# EAGLE design PiHAT (EAGLE 7.6.0)
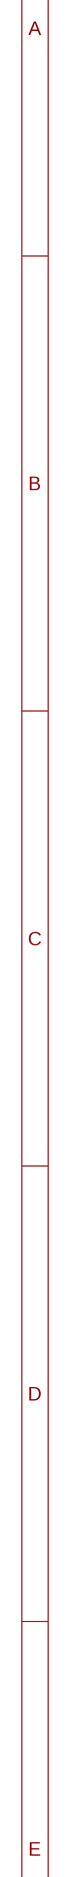
[diagram p0: schematic, sheet 1, part 1 of 2]
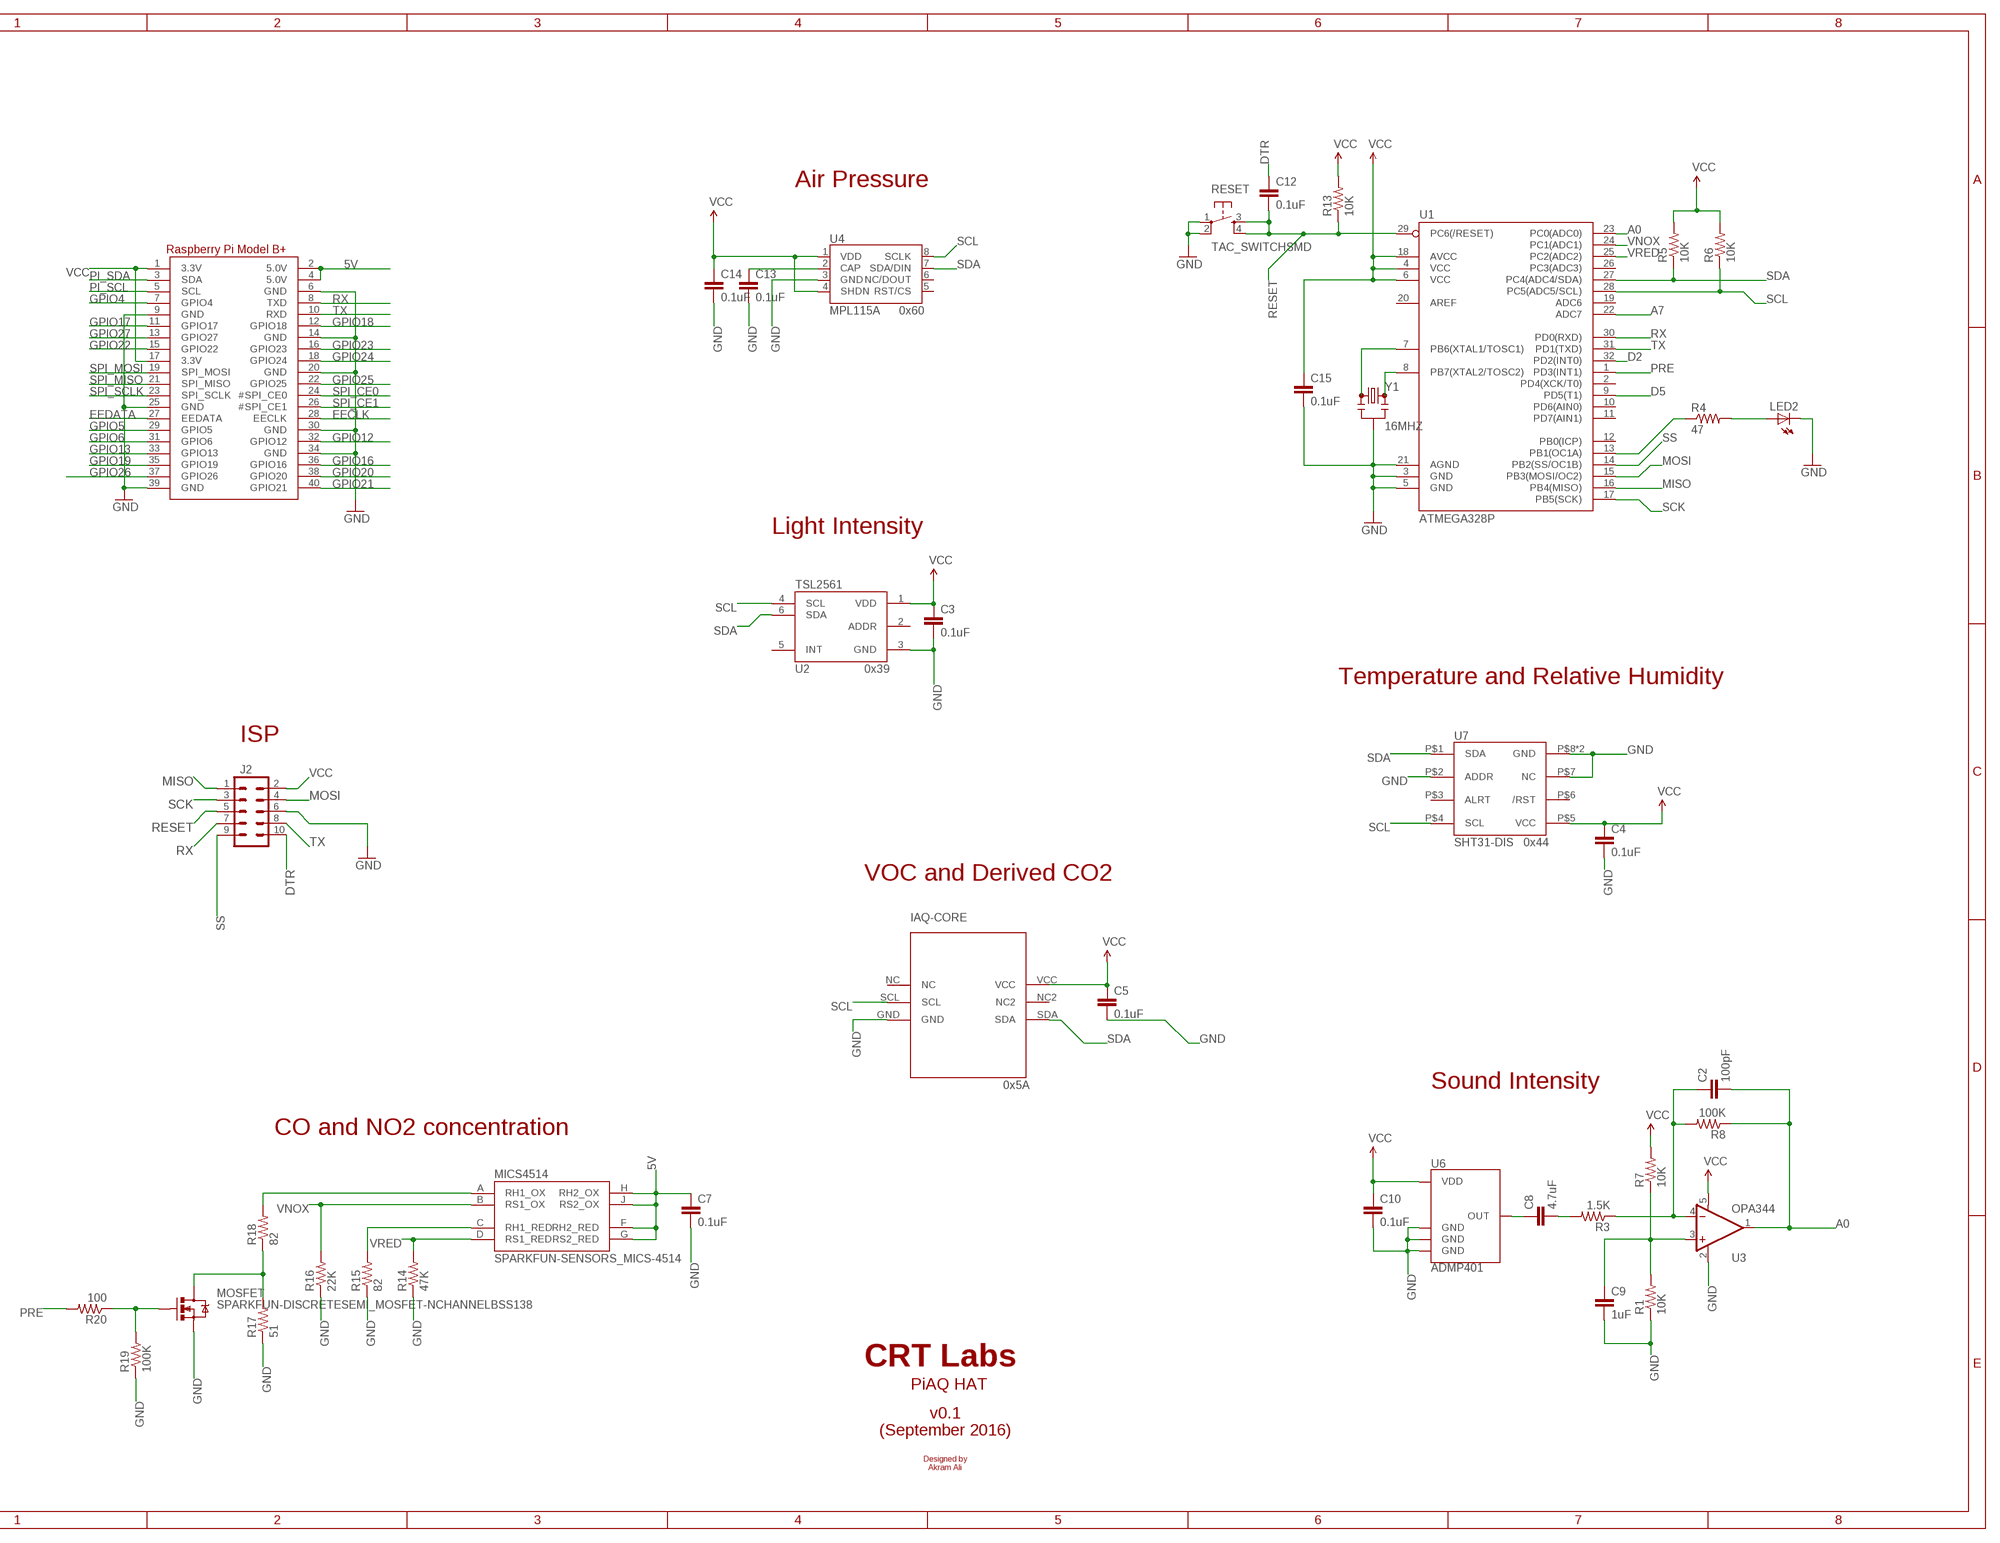
[diagram p1: schematic, sheet 1, part 2 of 2]

## Parts
C2  100pF  CAP0805  [0805]
C3  0.1uF  CAP0805  [0805]
C4  0.1uF  CAP0805  [0805]
C5  0.1uF  CAP0805  [0805]
C7  0.1uF  CAP0805  [0805]
C8  4.7uF  CAP0805  [0805]
C9  1uF  CAP0805  [0805]
C10  0.1uF  CAP0805  [0805]
C12  0.1uF  CAP0805  [0805]
C13  0.1uF  CAP0805  [0805]
C14  0.1uF  CAP0805  [0805]
C15  0.1uF  CAP0805  [0805]
IAQ-CORE  IAQ-CORE  [IAQ-CORE]
J2  M05X2PTH  [AVR_ICSP]
LED2  LEDCHIPLED_0805  [CHIPLED_0805]
MICS4514  SPARKFUN-SENSORS_MICS-4514  [SPARKFUN-SENSORS_MICS_10-SMD]
MOSFET  SPARKFUN-DISCRETESEMI_MOSFET-NCHANNELBSS138  [SPARKFUN-DISCRETESEMI_SOT23-3]
R1  10K  RESISTOR0805-RES  [0805]
R3  1.5K  RESISTOR0805-RES  [0805]
R4  47  RESISTOR0805-RES  [0805]
R5  10K  RESISTOR0805-RES  [0805]
R6  10K  RESISTOR0805-RES  [0805]
R7  10K  RESISTOR0805-RES  [0805]
R8  100K  RESISTOR0805-RES  [0805]
R13  10K  RESISTOR0805-RES  [0805]
R14  47K  RESISTOR0805-RES  [0805]
R15  82  RESISTOR0805-RES  [0805]
R16  22K  RESISTOR0805-RES  [0805]
R17  51  RESISTOR0805-RES  [0805]
R18  82  RESISTOR0805-RES  [0805]
R19  100K  RESISTOR0805-RES  [0805]
R20  100  RESISTOR0805-RES  [0805]
RESET  TAC_SWITCHSMD  [TACTILE-SWITCH-SMD]
RPI1  RASPBERRYPI_BPLUS_HATSLOTS  [PI_HAT_SLOTS]
U1  ATMEGA328P  ATMEGA328P_TQFP  [TQFP32-08]
U2  TSL2561  TSL2561FN  [FN-6]
U3  OPA344  [SOT23-5]
U4  MPL115A  [LGA8]
U6  ADMP401  [ADMP401]
U7  SHT31-DIS  [SHT3X]
Y1  16MHZ  RESONATOR16MHZ  [RESONATOR-SMD]

## Nets
5V: C7.1 MICS4514.F(RH2_RED) MICS4514.G(RS2_RED) MICS4514.H(RH2_OX) MICS4514.J(RS2_OX) RPI1.2(5.0V) RPI1.4(5.0V)
A0: C2.2 R8.1 U1.23(PC0(ADC0)) U3.1(OUT)
A7: U1.22(ADC7)
D2: U1.32(PD2(INT0))
D5: U1.9(PD5(T1))
DTR: C12.1 J2.10
EECLK: RPI1.28(EECLK)
EEDATA: RPI1.27(EEDATA)
GND: C3.2 C4.2 C5.2 C7.2 C9.2 C10.2 C13.2 C14.2 C15.2 IAQ-CORE.GND J2.6 LED2.C MOSFET.2(S) R1.1 R14.1 R15.1 R16.1 R17.1 R19.1 RESET.1 RESET.2 RPI1.6(GND) RPI1.9(GND) RPI1.14(GND) RPI1.20(GND) RPI1.25(GND) RPI1.30(GND) RPI1.34(GND) RPI1.39(GND) U1.3(GND) U1.5(GND) U1.21(AGND) U2.3(GND) U3.2(V-) U4.3(GND) U6.2(GND) U6.4(GND) U6.6(GND) U7.P$2(ADDR) U7.P$7(NC) U7.P$8(GND) U7.PAD(GND) Y1.2
GPIO4: RPI1.7(GPIO4)
GPIO5: RPI1.29(GPIO5)
GPIO6: RPI1.31(GPIO6)
GPIO12: RPI1.32(GPIO12)
GPIO13: RPI1.33(GPIO13)
GPIO16: RPI1.36(GPIO16)
GPIO17: RPI1.11(GPIO17)
GPIO18: RPI1.12(GPIO18)
GPIO19: RPI1.35(GPIO19)
GPIO20: RPI1.38(GPIO20)
GPIO21: RPI1.40(GPIO21)
GPIO22: RPI1.15(GPIO22)
GPIO23: RPI1.16(GPIO23)
GPIO24: RPI1.18(GPIO24)
GPIO25: RPI1.22(GPIO25)
GPIO26: RPI1.37(GPIO26)
GPIO27: RPI1.13(GPIO27)
MISO: J2.1 U1.16(PB4(MISO))
MOSI: J2.4 U1.15(PB3(MOSI/OC2))
N$2: R4.1 U1.13(PB1(OC1A))
N$3: LED2.A R4.2
N$4: U1.8(PB7(XTAL2/TOSC2)) Y1.3
N$5: U1.7(PB6(XTAL1/TOSC1)) Y1.1
N$7: C8.1 U6.1(OUT)
N$8: MICS4514.A(RH1_OX) R18.2
N$9: C8.2 R3.2
N$10: C2.1 R3.1 R8.2 U3.4(-IN)
N$11: C9.1 R1.2 R7.1 U3.3(+IN)
N$12: C13.1 U4.2(CAP)
N$13: MICS4514.C(RH1_RED) R15.2
N$20: MOSFET.3(D) R17.2 R18.1
N$23: MOSFET.1(G) R19.2 R20.1
PI_SCL: RPI1.5(SCL)
PI_SDA: RPI1.3(SDA)
PRE: R20.2 U1.1(PD3(INT1))
RESET: C12.2 J2.5 R13.1 RESET.3 RESET.4 U1.29(PC6(/RESET))
RX: J2.7 RPI1.8(TXD) U1.30(PD0(RXD))
SCK: J2.3 U1.17(PB5(SCK))
SCL: IAQ-CORE.SCL R6.1 U1.28(PC5(ADC5/SCL)) U2.4(SCL) U4.8(SCLK) U7.P$4(SCL)
SDA: IAQ-CORE.SDA R5.1 U1.27(PC4(ADC4/SDA)) U2.6(SDA) U4.7(SDA/DIN) U7.P$1(SDA)
SPI_CE0: RPI1.24(#SPI_CE0)
SPI_CE1: RPI1.26(#SPI_CE1)
SPI_MISO: RPI1.21(SPI_MISO)
SPI_MOSI: RPI1.19(SPI_MOSI)
SPI_SCLK: RPI1.23(SPI_SCLK)
SS: J2.9 U1.14(PB2(SS/OC1B))
TX: J2.8 RPI1.10(RXD) U1.31(PD1(TXD))
VCC: C3.1 C4.1 C5.1 C10.1 C14.1 C15.1 IAQ-CORE.VCC J2.2 R5.2 R6.2 R7.2 R13.2 RPI1.1(3.3V) RPI1.17(3.3V) U1.4(VCC) U1.6(VCC) U1.18(AVCC) U2.1(VDD) U3.5(V+) U4.1(VDD) U4.4(SHDN) U6.5(VDD) U7.P$5(VCC)
VNOX: MICS4514.B(RS1_OX) R16.2 U1.24(PC1(ADC1))
VRED: MICS4514.D(RS1_RED) R14.2 U1.25(PC2(ADC2))
Unconnected: IAQ-CORE.NC IAQ-CORE.NC2 U1.2(PD4(XCK/T0)) U1.10(PD6(AIN0)) U1.11(PD7(AIN1)) U1.12(PB0(ICP)) U1.19(ADC6) U1.20(AREF) U1.26(PC3(ADC3)) U2.2(ADDR) U2.5(INT) U4.5(RST/CS) U4.6(NC/DOUT) U7.P$3(ALRT) U7.P$6(/RST)

## Notes on the sheet
- Air Pressure
- 0x60
- Light Intensity
- 0x39
- Temperature and Relative Humidity
- ISP
- 0x44
- VOC and Derived CO2
- 0x5A | Sound Intensity
- CO and NO2 concentration
- CRT Labs
- PiAQ HAT
- v0.1
  (September 2016)
- Designed by
  Akram Ali

## Library data of the parts
C2 = SparkFun-Capacitors:CAP: Capacitor Standard 0603 ceramic capacitor, and 0.1" leaded capacitor.; DIGIKEY#: 311-1111-1-ND
C3-C5 C7 C12-C15 = SparkFun-Passives:CAP: Capacitor Standard 0603 ceramic capacitor, and 0.1" leaded capacitor.; DIGIKEY#: 311-1088-1-ND
C8 = SparkFun-Capacitors:CAP: Capacitor Standard 0603 ceramic capacitor, and 0.1" leaded capacitor.; DIGIKEY#: 311-1871-1-ND
C9 = SparkFun-Capacitors:CAP: Capacitor Standard 0603 ceramic capacitor, and 0.1" leaded capacitor.; DIGIKEY#: 311-1365-1-ND
C10 = SparkFun-Capacitors:CAP: Capacitor Standard 0603 ceramic capacitor, and 0.1" leaded capacitor.; DIGIKEY#: 311-1088-1-ND
IAQ-CORE = IAQ-CORE:IAQ-CORE; DIGIKEY#: IAQ-CORE C-ND; MPN: IAQ CORE; OC_NEWARK: 82Y5455
J2 = SparkFun-Connectors:M05X2: Header 5x2 Standard 10-pin dual row 0.1" header. Commonly used with AVR-ISP. Use with Spark Fun Electronics SKU: PRT-00778; DIGIKEY#: S6105-ND
LED2 = adafruit:LED: LED OSRAM: - CHIPLED LG R971, LG N971, LY N971, LG Q971, LY Q971, LO R971, LY R971 LH N974, LH R974 LS Q976, LO Q976, LY Q976 LO Q996 - Hyper CHIPLED LW Q18S LB Q993, LB Q99A, LB R99A - SideLED LS A670, LO A670, LY A670, LG A670, LP A670 LB A673, LV A673, LT A673, LW A673 LH A674 LY A675 LS A676, LA A676, LO A676, LY A676, LW A676 LS A679, LY A679, LG A679 - Hyper Micro SIDELED® LS Y876, LA Y876, LO Y876, LY Y876 LT Y87S - SmartLED LW L88C, LW L88S LB L89C, LB L89S, LG L890 LS L89K, LO L89K, LY L89K LS L896, LA L896, LO L896, LY L896 - TOPLED LS T670, LO T670, LY T670, LG T670, LP T670 LSG T670, LSP T670, LSY T670, LOP T670, LYG T670 LG T671, LOG T671, LSG T671 LB T673, LV T673, LT T673, LW T673 LH T674 LS T676, LA T676, LO T676, LY T676, LB T676, LH T676, LSB T676, LW T676 LB T67C, LV T67C, LT T67C, LS T67K, LO T67K, LY T67K, LW E67C LS E67B, LA E67B, LO E67B, LY E67B, LB E67C, LV E67C, LT E67C LW T67C LS T679, LY T679, LG T679 LS T770, LO T770, LY T770, LG T770, LP T770 LB T773, LV T773, LT T773, LW T773 LH T774 LS E675, LA E675, LY E675, LS T675 LS T776, LA T776, LO T776, LY T776, LB T776 LHGB T686 LT T68C, LB T68C - Hyper Mini TOPLED® LB M676 - Mini TOPLED Santana® LG M470 LS M47K, LO M47K, LY M47K Source: http://www.osram.convergy.de/; DIGIKEY#: 475-1196-1-ND; OC_NEWARK: unknown
MICS4514 = MICS-4514_CO_and_NOx_Sensor_Breakout:SPARKFUN-SENSORS_MICS-4514: Metal oxide MEMS carbon monoxide (CO) and NOx sensor in an SMD package.; PROD_ID: COMP-12310
MOSFET = MICS-4514_CO_and_NOx_Sensor_Breakout:SPARKFUN-DISCRETESEMI_MOSFET-NCHANNEL: Common NMOSFET Parts MFG P/N Store ID Prod ID FDD8780 TRANS-09984 SI7820DN TRANS-11055 FDS6630A IC-08089 2N7002PW TRANS-11151 FQP30N06L COM-10213 TRANS-10060 BSS123LT1G TRANS-08345 BSS138 TRANS-00830 BS170 2N7000; PROD_ID: TRANS-00830
R1 R7 R13 = SparkFun-Passives:RESISTOR: Resistor Basic schematic elements and footprints for 0603, 1206, and PTH resistors.; DIGIKEY#: 311-10KARCT-ND
R3 = SparkFun-Passives:RESISTOR: Resistor Basic schematic elements and footprints for 0603, 1206, and PTH resistors.; DIGIKEY#: YAG1814CT-ND
R4 = SparkFun-Resistors:RESISTOR: Resistor Basic schematic elements and footprints for 0603, 1206, and PTH resistors.; DIGIKEY#: 311-47ARCT-ND; OC_NEWARK: unknown
R5 R6 = SparkFun-Resistors:RESISTOR: Resistor Basic schematic elements and footprints for 0603, 1206, and PTH resistors.; DIGIKEY#: 311-10KARCT-ND
R8 R15 R18 = SparkFun-Passives:RESISTOR: Resistor Basic schematic elements and footprints for 0603, 1206, and PTH resistors.; DIGIKEY#: 541-82.0CCT-ND
R14 = SparkFun-Passives:RESISTOR: Resistor Basic schematic elements and footprints for 0603, 1206, and PTH resistors.; DIGIKEY#: RHM47KKCT-ND; OC_NEWARK: unknown
R16 = SparkFun-Passives:RESISTOR: Resistor Basic schematic elements and footprints for 0603, 1206, and PTH resistors.; DIGIKEY#: 311-22KARCT-ND; OC_NEWARK: unknown
R17 = SparkFun-Passives:RESISTOR: Resistor Basic schematic elements and footprints for 0603, 1206, and PTH resistors.; DIGIKEY#: RHM51KCT-ND
R19 = SparkFun-Passives:RESISTOR: Resistor Basic schematic elements and footprints for 0603, 1206, and PTH resistors.; DIGIKEY#: 311-100KCRCT-ND
R20 = SparkFun-Passives:RESISTOR: Resistor Basic schematic elements and footprints for 0603, 1206, and PTH resistors.; DIGIKEY#: 311-100CRCT-ND
RESET = SparkFun-Retired:TAC_SWITCH: Momentary Switch Button commonly used for reset or general input. Spark Fun Electronics SKU : COM-00097 SMT- SWCH-08247; DIGIKEY#: CKN9104CT-ND; PROD_ID: SWCH-08247
RPI1 = microbuilder:RASPBERRYPI_BPLUS
U1 = SparkFun-DigitalIC:ATMEGA328P_TQFP; DIGIKEY#: ATMEGA328P-AU-ND; MPN: ATMEGA328PB-AU; OC_NEWARK: 58Y6083; PROD_ID: IC-09069; VALUE: ATMEGA328P_TQFP
U2 = SparkFun-DigitalIC:TSL2561: TSL2561 illumination sensor Approximates Human Eye Response Precisely Measures Illuminance Programmable Interrupt Function with User-Defined Upper and Lower Threshold 400 KHz I2C interface Programmable Analog Gain and Integration Time Supporting 1,000,000-to-1 Dynamic Range Automatically Rejects 50/60-Hz Lighting Ripple Low Active Power (0.75 mW Typical) with Power Down Mode RoHS Compliant The TSL2561 is a light-to-digital converter that transform light intensity to a digital signal output via I2C interface. The device combines one broadband photodiode (visible plus infrared) and one infrared-responding photodiode on a single CMOS integrated circuit capable of providing a near-photopic response over an effective 20-bit dynamic range (16-bit resolution). Two integrating ADCs convert the photodiode currents to a digital output that represents the irradiance measured on each channel. This digital output can be input to a microprocessor where illuminance (ambient light level) in lux is derived using an empirical formula to approximate the human eye response. The TSL2561 device supports a traditional level style interrupt that remains asserted until the firmware clears it.; DIGIKEY#: TSL2561-FNCT-ND; MANF: AMS-TAOS-USA-Inc.; MANF#: TSL2561FN; MOUSER#: 856-TSL2561T; MPN: TSL2561FN; OC_NEWARK: 82Y5564; PROD_ID: IC-11791
U3 = SparkFun-AnalogIC:OPA344: Single gate rail-to-rail output op-amp. Inputs extend 300mV past rails.; DIGIKEY#: 296-41475-1-ND; PROD_ID: IC-08251
U4 = SparkFun-Sensors:MPL115A: MPL115A1 (SPI) and MPL115A2 (I2C) Miniature Digital Barometer 5.0x3.0x1.2mm LGA Package; DIGIKEY#: MPL115A2-ND
U6 = SparkFun-Sensors:ADMP401: Omnidirection bottom-port MEMS microphone; DIGIKEY#: INMP401ACEZ-R7CT-ND
U7 = thomasb9511:SHT31-DIS; DIGIKEY#: 1649-1011-1-ND; MPN: SHT31-DIS-B; OC_NEWARK: 47Y1304
Y1 = SparkFun-FreqCtrl:RESONATOR: Resonator Small SMD resonator. Used, eg, on the Arduino Pro/ Pro Mini boards. 8MHz- XTAL-08895 16MHz- XTAL-08900; DIGIKEY#: 490-1198-1-ND; OC_NEWARK: unknown; PROD_ID: XTAL-08900

## Board
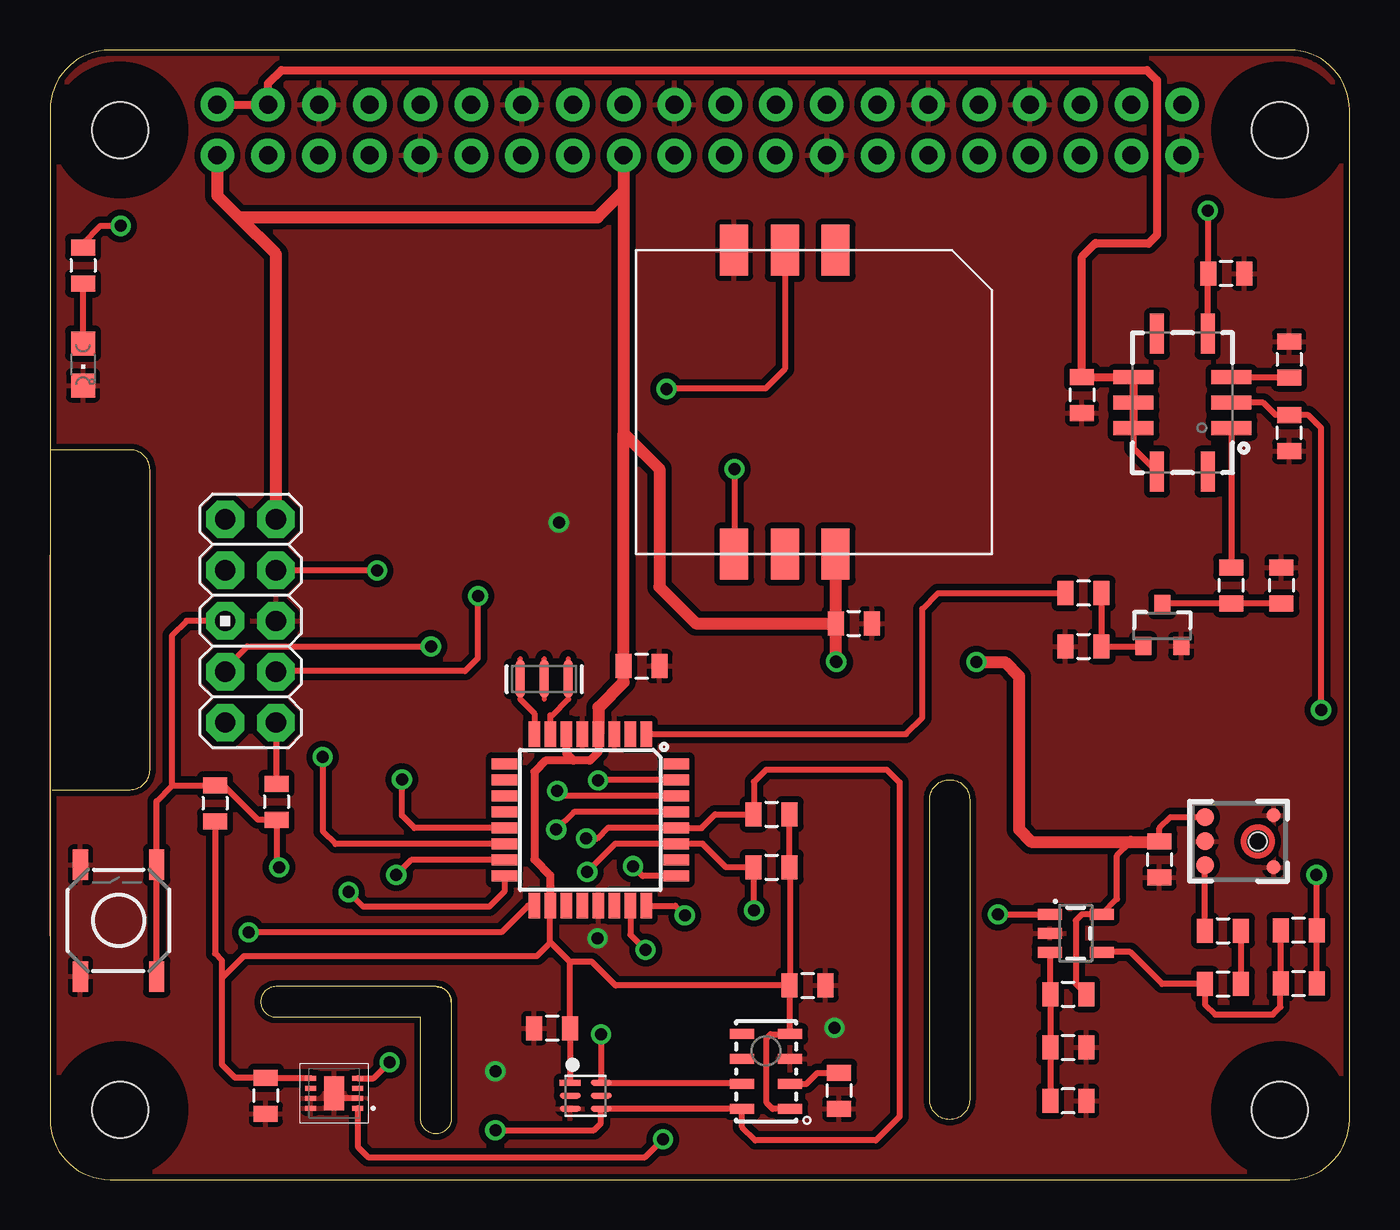
[diagram p2: board, top side]
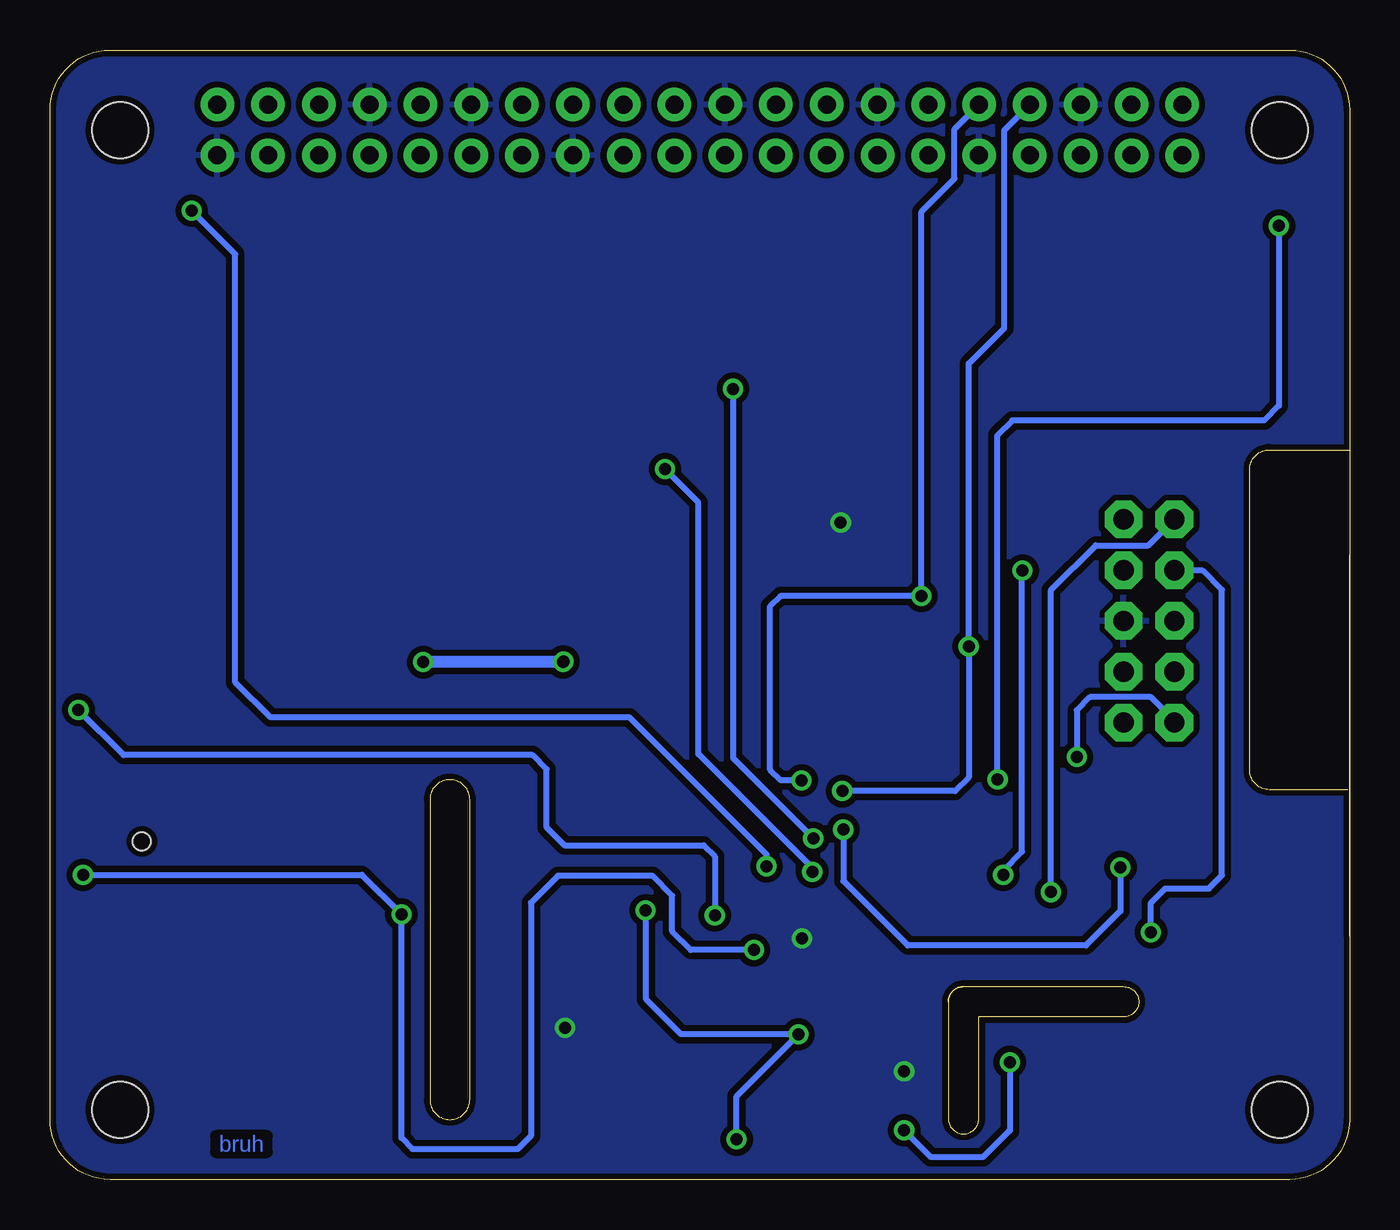
[diagram p3: board, bottom side, seen from below]

Size 65 x 56.5 mm. Coordinates in mm from the lower left corner, seen from the top.
Outline: 0,19.56 0,19.68
Outline: 0,12.19 0,31.24
Outline: 20.07,8.89 arc90 19.3,9.65
Outline: 19.3,9.65 11.3,9.65 arc90 10.54,8.89 arc90 11.3,8.13 18.54,8.13 18.54,3.05 arc90 19.3,2.29 arc90 20.07,3.05 20.07,8.89
Outline: 19.3,9.65 arc-90 20.07,8.89
Copper layers (1*16): Top 0.035mm / dielectric 1.5mm / Bottom 0.035mm
Design rules "adafruit *": minimum track width 7mil, minimum drill 15.5mil, track to track 7mil, track to pad 7mil, pad to pad 7mil, via to via 8mil, smd to smd 8mil, copper to edge 10mil, drill to drill 8mil, minimum pad ring 10mil, minimum via ring 8mil, stop-mask expansion 2mil, vias tented up to drill 20mil, thermal gap 10mil

### Footprints (pad centres in the part's own frame; a part is rotated, then mirrored left to right if it is on the bottom)
0805 = smd 0.8 x 1.2: 1 -0.9,0; 2 0.9,0
IAQ-CORE = smd 2.54 x 1.4: GND 0,-12.9; NC 0,-7.82; NC2 15.2,-10.36; SCL 0,-10.36; SDA 15.2,-12.9; VCC 15.2,-7.82
AVR_ICSP = drill 1.016 pad 1.88 octagon: 1 -1.27,5.08; 2 1.27,5.08; 3 -1.27,2.54; 4 1.27,2.54; 5 -1.27,0; 6 1.27,0; 7 -1.27,-2.54; 8 1.27,-2.54; 9 -1.27,-5.08; 10 1.27,-5.08
CHIPLED_0805 = smd 1.2 x 1.2: A 0,-1.05; C 0,1.05
SPARKFUN-SENSORS_MICS_10-SMD = smd 0.7 x 2: A 1.27,2.45; B 0,2.45; C -1.27,2.45; F -1.27,-2.45; G 0,-2.45; H 1.27,-2.45 | smd 2 x 0.7: D -3.45,1.27; E -3.45,-1.27; J 3.45,-1.27; K 3.45,1.27
SPARKFUN-DISCRETESEMI_SOT23-3 = smd 0.8 x 0.9: 1 -0.95,-1; 2 0.95,-1; 3 0,1.1
TACTILE-SWITCH-SMD = smd 1.524 x 0.762: 1 -2.794,1.905; 2 2.794,1.905; 3 -2.794,-1.905; 4 2.794,-1.905
PI_HAT_SLOTS = drill 0.9 pad 1.676: 1 8.37,51.23; 2 8.37,53.77; 3 10.91,51.23; 4 10.91,53.77; 5 13.45,51.23; 6 13.45,53.77; 7 15.99,51.23; 8 15.99,53.77; 9 18.53,51.23; 10 18.53,53.77; 11 21.07,51.23; 12 21.07,53.77; 13 23.61,51.23; 14 23.61,53.77; 15 26.15,51.23; 16 26.15,53.77; 17 28.69,51.23; 18 28.69,53.77; 19 31.23,51.23; 20 31.23,53.77; 21 33.77,51.23; 22 33.77,53.77; 23 36.31,51.23; 24 36.31,53.77; 25 38.85,51.23; 26 38.85,53.77; 27 41.39,51.23; 28 41.39,53.77; 29 43.93,51.23; 30 43.93,53.77; 31 46.47,51.23; 32 46.47,53.77; 33 49.01,51.23; 34 49.01,53.77; 35 51.55,51.23; 36 51.55,53.77; 37 54.09,51.23; 38 54.09,53.77; 39 56.63,51.23; 40 56.63,53.77 | hole 2.8: 3.5,3.5; 3.5,52.5; 61.5,52.5; 61.5,3.5
TQFP32-08 = smd 1.27 x 0.559: 1 -4.293,2.8; 2 -4.293,2; 3 -4.293,1.2; 4 -4.293,0.4; 5 -4.293,-0.4; 6 -4.293,-1.2; 7 -4.293,-2; 8 -4.293,-2.8; 17 4.293,-2.8; 18 4.293,-2; 19 4.293,-1.2; 20 4.293,-0.4; 21 4.293,0.4; 22 4.293,1.2; 23 4.293,2; 24 4.293,2.8 | smd 0.559 x 1.27: 9 -2.8,-4.293; 10 -2,-4.293; 11 -1.2,-4.293; 12 -0.4,-4.293; 13 0.4,-4.293; 14 1.2,-4.293; 15 2,-4.293; 16 2.8,-4.293; 25 2.8,4.293; 26 2,4.293; 27 1.2,4.293; 28 0.4,4.293; 29 -0.4,4.293; 30 -1.2,4.293; 31 -2,4.293; 32 -2.8,4.293
FN-6 = smd 1.05 x 0.3: 1 -0.775,0.65; 2 -0.775,0; 3 -0.775,-0.65; 4 0.775,-0.65; 5 0.775,0; 6 0.775,0.65
SOT23-5 = smd 0.55 x 1.2: 1 -0.95,-1.3; 2 0,-1.3; 3 0.95,-1.3; 4 0.95,1.3; 5 -0.95,1.3
LGA8 = smd 1.2 x 0.5: 1 -1.2,1.875; 2 -1.2,0.625; 3 -1.2,-0.625; 4 -1.2,-1.875; 5 1.2,-1.875; 6 1.2,-0.625; 7 1.2,0.625; 8 1.2,1.875
ADMP401 = smd 0.9 x 0.9: 1 -1.2,2.62; 5 1.2,2.62; 6 0,2.62 | smd 0.7 x 0.7: 2 1.3,-0.8; 4 -1.3,-0.8 | hole 0.9: 0,0
SHT3X = smd 0.55 x 0.25: P$1 -1.175,0.75; P$2 -1.175,0.25; P$3 -1.175,-0.25; P$4 -1.175,-0.75; P$5 1.175,-0.75; P$6 1.175,-0.25; P$7 1.175,0.25; P$8 1.175,0.75 | smd 1 x 1.7: PAD 0,0
RESONATOR-SMD = smd 0.45 x 1.905: 1 -1.2,0; 2 0,0; 3 1.2,0

### Placement (x,y rotation side)
C2  62.46,9.8 0 top
C3  25.12,7.57 180 top
C4  10.79,4.19 270 top
C5  40.21,27.81 0 top
C7  51.61,39.24 270 top
C8  58.67,12.45 0 top
C9  50.93,6.6 0 top
C10  55.5,16 270 top
C12  11.33,18.9 270 top
C13  39.47,4.45 270 top
C14  37.9,9.7 0 top
C15  29.59,25.68 0 top
IAQ-CORE  47.12,46.48 270 top
J2  10.03,27.94 0 top
LED2  1.65,40.77 180 top
MICS4514  56.64,38.86 270 top
MOSFET  55.63,27.69 0 top
R1  50.93,3.94 180 top
R3  58.67,9.78 0 top
R4  1.65,45.72 270 top
R5  36.09,15.62 0 top
R6  36.09,18.26 0 top
R7  50.93,9.27 0 top
R8  62.46,12.47 180 top
R13  8.26,18.82 270 top
R14  58.83,45.31 180 top
R15  61.98,41.02 270 top
R16  61.98,37.34 90 top
R17  61.59,29.72 270 top
R18  59.08,29.72 90 top
R19  51.69,26.67 0 top
R20  51.69,29.34 180 top
RESET  3.43,12.95 90 top
RPI1  0,0 0 top
U1  27.03,17.98 270 top
U2  26.8,4.19 0 top
U3  51.31,12.32 270 top
U4  35.81,5.41 180 top
U6  60.4,16.92 90 top
U7  14.22,4.32 180 top
Y1  24.71,25.04 180 top

### Tracks (layer width: path | path; a pad name or v marks a point on that pad's centre or on a via)
5V
  Top 0.305: MICS4514.H 54.19,36.59 MICS4514.J
  Top 0.406: RPI1.2 RPI1.4 10.91,54.83 11.58,55.5 54.86,55.5 55.37,54.99 55.37,47.24 54.94,46.81 52.32,46.81 52.3,46.84 51.61,46.15 C7.1 54.18,40.14 MICS4514.F | 54.18,40.15 MICS4514.F | MICS4514.F MICS4514.G MICS4514.H
A0  (via drill 0.6)
  Top 0.305: U1.23 29.03,12.25 v29.79,11.48 | v47.42,13.26 50,13.26 U3.1 | C2.2 R8.1 63.36,15.23 v63.35,15.24
  Bottom 0.305: v29.79,11.48 32.94,11.48 33.88,12.42 33.88,14.2 34.87,15.19 39.6,15.19 40.95,13.84 40.95,2.18 41.6,1.52 46.86,1.52 47.42,2.08 v47.42,13.26 49.4,15.24 v63.35,15.24
DTR
  Top 0.305: C12.1 11.33,22.84 J2.10
GND  (via drill 0.6)
  Top 0.305: U7.P$2 14.47,4.07 U7.PAD
  other vias: 22.28,5.41 27.38,12.06 39.24,7.59 25.45,32.87
  pour Top (isolate 0.305): -0.76,56.9 65.53,56.9 65.53,-0.51 -0.89,-0.51 -0.89,56.9
  pour Bottom (isolate 0.305): 0.08,57.05 65.53,57.05 65.53,-0.23 -0.38,-0.23 -0.38,57.05
MISO  (via drill 0.6)
  Top 0.305: U1.16 22.73,14.4 21.97,13.64 15.67,13.64 v14.94,14.38
  Bottom 0.305: v14.94,14.38 14.94,29.49 12.7,31.72 10.06,31.72 J2.1
MOSI  (via drill 0.6)
  Top 0.305: v16.36,30.45 11.33,30.45 J2.4 | U1.15 18.07,15.98 v17.32,15.24
  Bottom 0.305: v17.32,15.24 17.32,15.47 16.38,16.41 16.38,30.43 v16.36,30.45
N$2  (via drill 0.6)
  Top 0.305: 22.78,17.55 22.75,17.58 U1.13 18.23,17.58 17.6,18.21 v17.6,20.02 | 1.66,46.61 R4.1 1.65,46.84 2.52,47.7 v3.53,47.7
  Bottom 0.305: v17.6,20.02 17.6,37.24 16.87,37.97 4.27,37.97 3.53,38.71 v3.53,47.7
N$3
  Top 0.305: LED2.A R4.2
N$4
  Top 0.305: U1.8 24.23,23.31 23.51,24.03
N$5
  Top 0.305: U1.7 25.02,22.28 25.02,23.22 25.1,23.22 25.91,24.03
N$7
  Top 0.305: C8.1 U6.1
N$8
  Top 0.305: MICS4514.A 59.09,30.63 R18.2
N$9
  Top 0.305: C8.2 R3.2
N$10
  Top 0.305: U3.4 54.03,11.38 55.63,9.78 R3.1 57.77,8.75 58.27,8.26 61.16,8.26 61.54,8.64 61.54,9.79 C2.1 R8.2
N$11
  Top 0.305: U3.3 50.01,9.29 R7.1 C9.1 R1.2
N$12
  Top 0.305: U4.2 37.83,4.79 38.38,5.33 39.46,5.33 C13.1
N$13
  Top 0.305: MICS4514.C 61.97,40.13 R15.2
N$20
  Top 0.305: R17.2 R18.1 55.66,28.82 MOSFET.3
N$23
  Top 0.305: R20.1 R19.2 54.66,26.67 MOSFET.1
PRE
  Top 0.305: 50.76,29.31 R20.2 44.42,29.34 43.64,28.55 43.64,23.09 42.82,22.28 U1.1
RESET  (via drill 0.6)
  Top 0.305: RESET.3 RESET.4 5.33,18.92 6.1,19.68 | U1.29 | 6.1,19.68 6.12,19.71 8.24,19.71 R13.1 8.68,19.72 10.39,18.01 11.32,18.01 C12.2 11.33,15.75 v11.46,15.62 | J2.5 6.83,27.94 6.1,27.2 6.1,19.68 | U1.29 | U1.29 26.21,18.38 v25.32,17.5
  Bottom 0.305: v11.46,15.62 11.46,13.44 13.18,11.71 22.1,11.71 25.32,14.93 v25.32,17.5
RX  (via drill 0.6)
  Top 0.305: J2.7 8.76,25.55 9.88,26.67 v19.05,26.67 | U1.30 25.63,19.18 v25.38,19.43
  Bottom 0.305: v25.38,19.43 19.74,19.43 19.05,20.12 v19.05,26.67 19.05,40.82 17.27,42.6 17.27,52.48 15.99,53.76 RPI1.8
SCK  (via drill 0.6)
  Top 0.305: U1.17 23.9,13.69 22.58,12.37 v9.93,12.37
  Bottom 0.305: J2.3 8.74,30.45 7.34,30.45 6.38,29.49 6.38,15.21 7.04,14.55 9.22,14.55 9.93,13.84 v9.93,12.37
SCL  (via drill 0.6)
  Top 0.305: IAQ-CORE.SCL 36.75,40.54 35.79,39.57 30.86,39.57 v30.84,39.55 | U7.P$4 16.19,5.07 v16.99,5.87 | v22.28,2.46 27.2,2.46 27.56,2.82 27.56,3.53 U2.4 U4.8 34.62,3.53 34.62,2.62 35.28,1.96 41.3,1.96 42.49,3.15 42.49,19.86 41.86,20.5 35.81,20.5 35.2,19.89 35.2,18.27 R6.1 33.27,18.26 32.59,17.58 U1.28 31.3,17.6 27.91,17.6 27.38,17.07 v26.82,17.07
  Bottom 0.305: v30.84,39.55 30.84,21.08 v26.82,17.07 | v16.99,5.87 16.99,2.41 17.04,2.41 18.34,1.12 20.93,1.12 v22.28,2.46
SDA  (via drill 0.6)
  Top 0.305: U4.7 34.56,4.84 U2.6 27.56,4.85 v27.56,7.26 | U7.P$1 15.42,3.55 15.42,1.6 15.9,1.12 29.77,1.12 v30.66,2.01 | U1.27 32.64,16.79 33.81,15.62 R5.1 35.2,15.61 v35.2,13.46 | U1.27 | U1.27 28.27,16.79 v26.87,15.39 | 34.21,31.29 IAQ-CORE.SDA 34.24,31.3 v34.24,35.54
  Bottom 0.305: v35.2,13.46 35.18,13.44 35.18,9.02 33.43,7.26 v27.56,7.26 30.66,4.17 v30.66,2.01 | v26.87,15.39 26.87,15.6 32.56,21.29 32.56,33.86 v34.24,35.54
SS  (via drill 0.6)
  Top 0.305: U1.14 14.28,16.78 13.64,17.42 v13.64,21.13
  Bottom 0.305: J2.9 8.76,22.96 9.93,24.13 12.98,24.13 13.64,23.47 v13.64,21.13
TX  (via drill 0.6)
  Top 0.305: J2.8 11.33,25.43 20.75,25.43 21.41,26.09 v21.41,29.18 | U1.31 27.43,19.98 v27.41,19.96
  Bottom 0.305: v27.41,19.96 28.45,19.96 28.98,20.5 28.98,28.68 28.47,29.18 v21.41,29.18 21.41,48.41 19.76,50.06 19.76,52.54 RPI1.10
VCC  (via drill 0.6)
  Top 0.305: U4.1 36.14,3.54 35.84,3.83 35.84,7.06 36.04,7.26 36.99,7.26 U4.4 37,7.3 C14.1 | U7.P$5 10.82,5.07 C4.1 9.26,5.09 8.61,5.74 8.61,10.08 | 8.61,10.08 9.7,11.18 24.36,11.18 25.02,11.84 25.02,11.89 | 25.02,11.89 25.02,13.68 U1.18 25.04,13.71 | 26.02,10.88 25.02,11.89 | R13.2 8.26,11.3 8.61,10.95 8.61,10.08 | 26.02,10.88 C3.1 U2.1 | 26.02,10.88 26.04,10.9 27.1,10.9 28.3,9.7 C14.1 | R6.2 R5.2 37.01,15.6 37.01,9.72 C14.1 | R7.2 51.31,9.79 51.31,12.95 51.62,13.27 U3.5 53.37,14.03 53.37,16.21 54.05,16.89 | C10.1 55.5,17.58 56.06,18.14 57.76,18.14 U6.5
  Top 0.406: U1.4 27.43,21.38 27,20.95 26.19,20.95 | 26.19,20.95 25.83,21.31 U1.6 | 26.19,20.95 24.79,20.95 24.23,20.4 24.23,16 25.02,15.21 25.02,13.7 U1.18
  Top 0.61: RPI1.1 8.37,49.21 9.34,48.25 9.45,48.13 | C5.1 IAQ-CORE.VCC | RPI1.17 28.69,49.43 | 28.69,49.43 28.69,37.34 | 9.45,48.13 27.39,48.13 28.69,49.43 | v39.32,25.91 C5.1 | v46.33,25.88 47.75,25.88 48.46,25.17 48.46,17.5 49.07,16.89 54.05,16.89 55.49,16.89 C10.1 | 28.69,37.34 30.48,35.55 30.48,29.64 32.31,27.81 C5.1 | U1.4 27.43,23.62 28.69,24.88 C15.1 28.69,37.34 | J2.2 11.3,46.28 9.45,48.13
  Bottom 0.305: v39.34,25.88 v39.32,25.91
  Bottom 0.61: v39.34,25.88 v46.33,25.88
VNOX  (via drill 0.6)
  Top 0.305: MICS4514.B 60.68,38.86 61.3,38.24 R16.2 61.99,38.23 62.94,38.23 63.58,37.59 v63.58,23.5 | U1.24 31.27,13.69 v31.75,13.21
  Bottom 0.305: v63.58,23.5 61.32,21.23 40.87,21.23 40.16,20.52 40.16,17.6 39.27,16.71 32.31,16.71 31.75,16.15 v31.75,13.21
VRED  (via drill 0.6)
  Top 0.305: MICS4514.D 57.91,45.3 R14.2 57.91,45.33 v57.91,48.46 | U1.25 29.65,15.18 v29.16,15.67
  Bottom 0.305: v29.16,15.67 29.16,16.26 36.02,23.11 53.98,23.11 55.73,24.87 55.73,46.28 v57.91,48.46

### Text on the board
Bottom: bruh
sName: 5V | TX | RX | 3.3V | Status / LED | ISP | v0.1 | MISO | 3.3V | SCK | MOSI | RESET | GND | RX | TX | SS | DTR | crtlabs.org